# Altium project pcb.PrjPcb
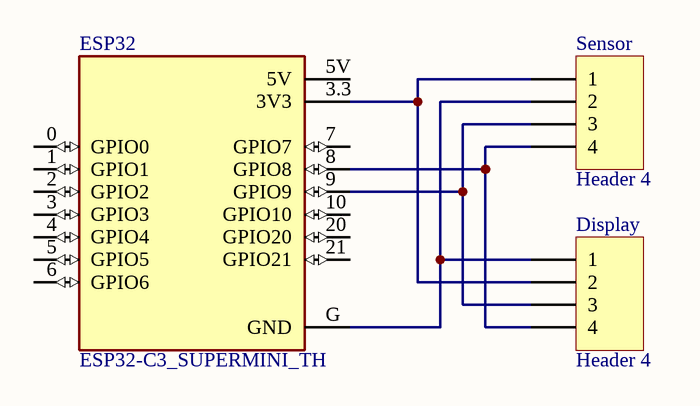
[diagram p0: airsensor.SchDoc]
1 sheet, 3 parts. Net scope: global (net labels, ports and power ports of the same name join across sheets).
Board file: airsensor_pcb.PcbDoc

## Sheet airsensor.SchDoc: Air sensor
size A4; Date: 28/05/2025; Author: Philipp Dona; CompanyName: HTL Anichstrasse; DrawnBy: Philipp Dona; DocumentNumber: 1; Revision: 0.1; SheetNumber: 1; SheetTotal: 1; HTL_Gruppe: I; HTL_Klasse: 4AHEL; HTL_Zusaetzlicher_Titel: uC-Werkstatt; HTL_Schueler_Name: Philipp Dona, Emre Altunkaya; PageSetup: Record=PageOptions|CenterHorizontal=True|CenterVertical=True|PrintScale=1.00|XCorrection=1.00|YCorrection=1.00|PrintKind=0|BorderSize=5000000|LeftOffset=0|BottomOffset=0|Orientation=2|PaperLength=1000|PaperWidth=1000|Scale=100|PaperSource=7|PrintQuality=-4|MediaType=1|DitherType=10|PaperKind=A4|PrintScaleMode=1; HTL_Projektname: Air Sensor; HTL_Dokumentenart: Schaltplan; HTL_Dokumentenstatus: Entwurf; Time: 9:27

### Parts
Display  Header 4  [HDR1X4]
ESP32  ESP32-C3_SUPERMINI_TH  [MODULE_ESP32-C3_SUPERMINI]
Sensor  Header 4  [HDR1X4]

### Nets
NetDisplay_1: Display.1 ESP32.G(GND) Sensor.2
NetDisplay_2: Display.2 ESP32.3.3(3V3) Sensor.1
NetDisplay_3: Display.3 ESP32.9(GPIO9) Sensor.3
NetDisplay_4: Display.4 ESP32.8(GPIO8) Sensor.4

Not connected (* = marked no-connect by the designer): ESP32 0(GPIO0) 1(GPIO1) 2(GPIO2) 3(GPIO3) 4(GPIO4) 5(GPIO5) 5V 6(GPIO6) 7(GPIO7) 10(GPIO10) 20(GPIO20) 21(GPIO21)

### Notes on the sheet
- Sachnummer / Dateiname:
- Name:
- Gruppe:
- Klasse:
- Elektronik &
- Technische Informatik
- Anichstraße 26 - 28
- HTBLVA
- Titel:
- Datum:
- Dokumentenart:
- Dokumentenstatus:
- A - 6020 Innsbruck
- Ver.:
- Blatt:
- Blätter:

### Library data of the parts
Display Sensor = Header 4: Header, 4-Pin; LatestRevisionDate: 17-Jul-2002; LatestRevisionNote: Re-released for DXP Platform.; Publisher: Altium Limited
ESP32 = ESP32-C3_SUPERMINI_TH: Super tiny ESP32-C3 board; MF: Espressif Systems; MP: ESP32-C3 SuperMini_TH; SnapEDA_Link: https://www.snapeda.com/parts/ESP32-C3%20SuperMini_TH/Espressif+Systems/view-part/?ref=snap; Package: Package; Value: *; Check_prices: https://www.snapeda.com/parts/ESP32-C3%20SuperMini_TH/Espressif+Systems/view-part/?ref=eda